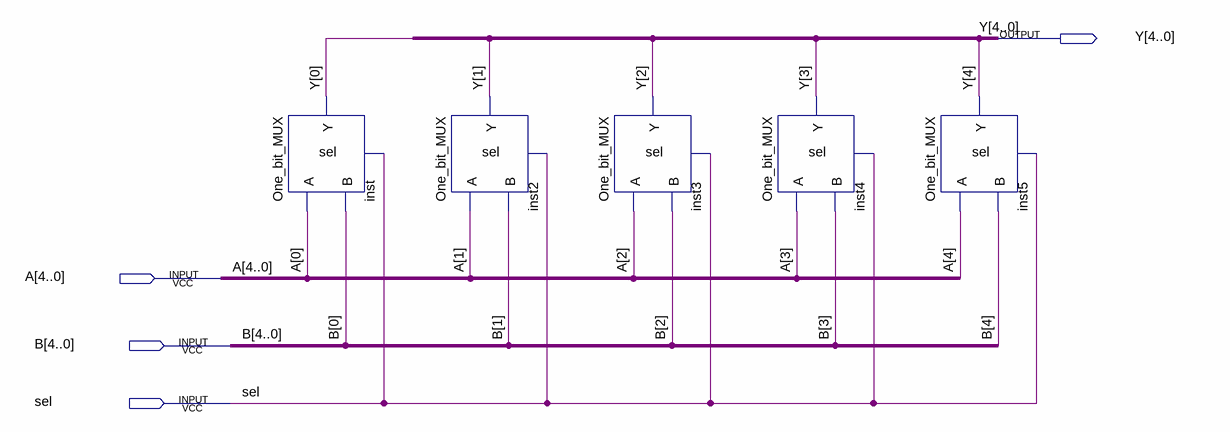
[diagram p0: schematic sheet]
// Quartus schematic Five_bit_MUX.bdf as structural Verilog: 5 symbols, 4 pins
module Five_bit_MUX (
  input  [4:0] A,
  input  [4:0] B,
  input  sel,
  output [4:0] Y
);

  One_bit_MUX inst (.A(A[0]), .sel(sel), .B(B[0]), .Y(Y[0]));
  One_bit_MUX inst2 (.A(A[1]), .sel(sel), .B(B[1]), .Y(Y[1]));
  One_bit_MUX inst3 (.A(A[2]), .sel(sel), .B(B[2]), .Y(Y[2]));
  One_bit_MUX inst4 (.A(A[3]), .sel(sel), .B(B[3]), .Y(Y[3]));
  One_bit_MUX inst5 (.A(A[4]), .sel(sel), .B(B[4]), .Y(Y[4]));
endmodule
